# EAGLE design s-tuner_prototype (EAGLE 6.1)
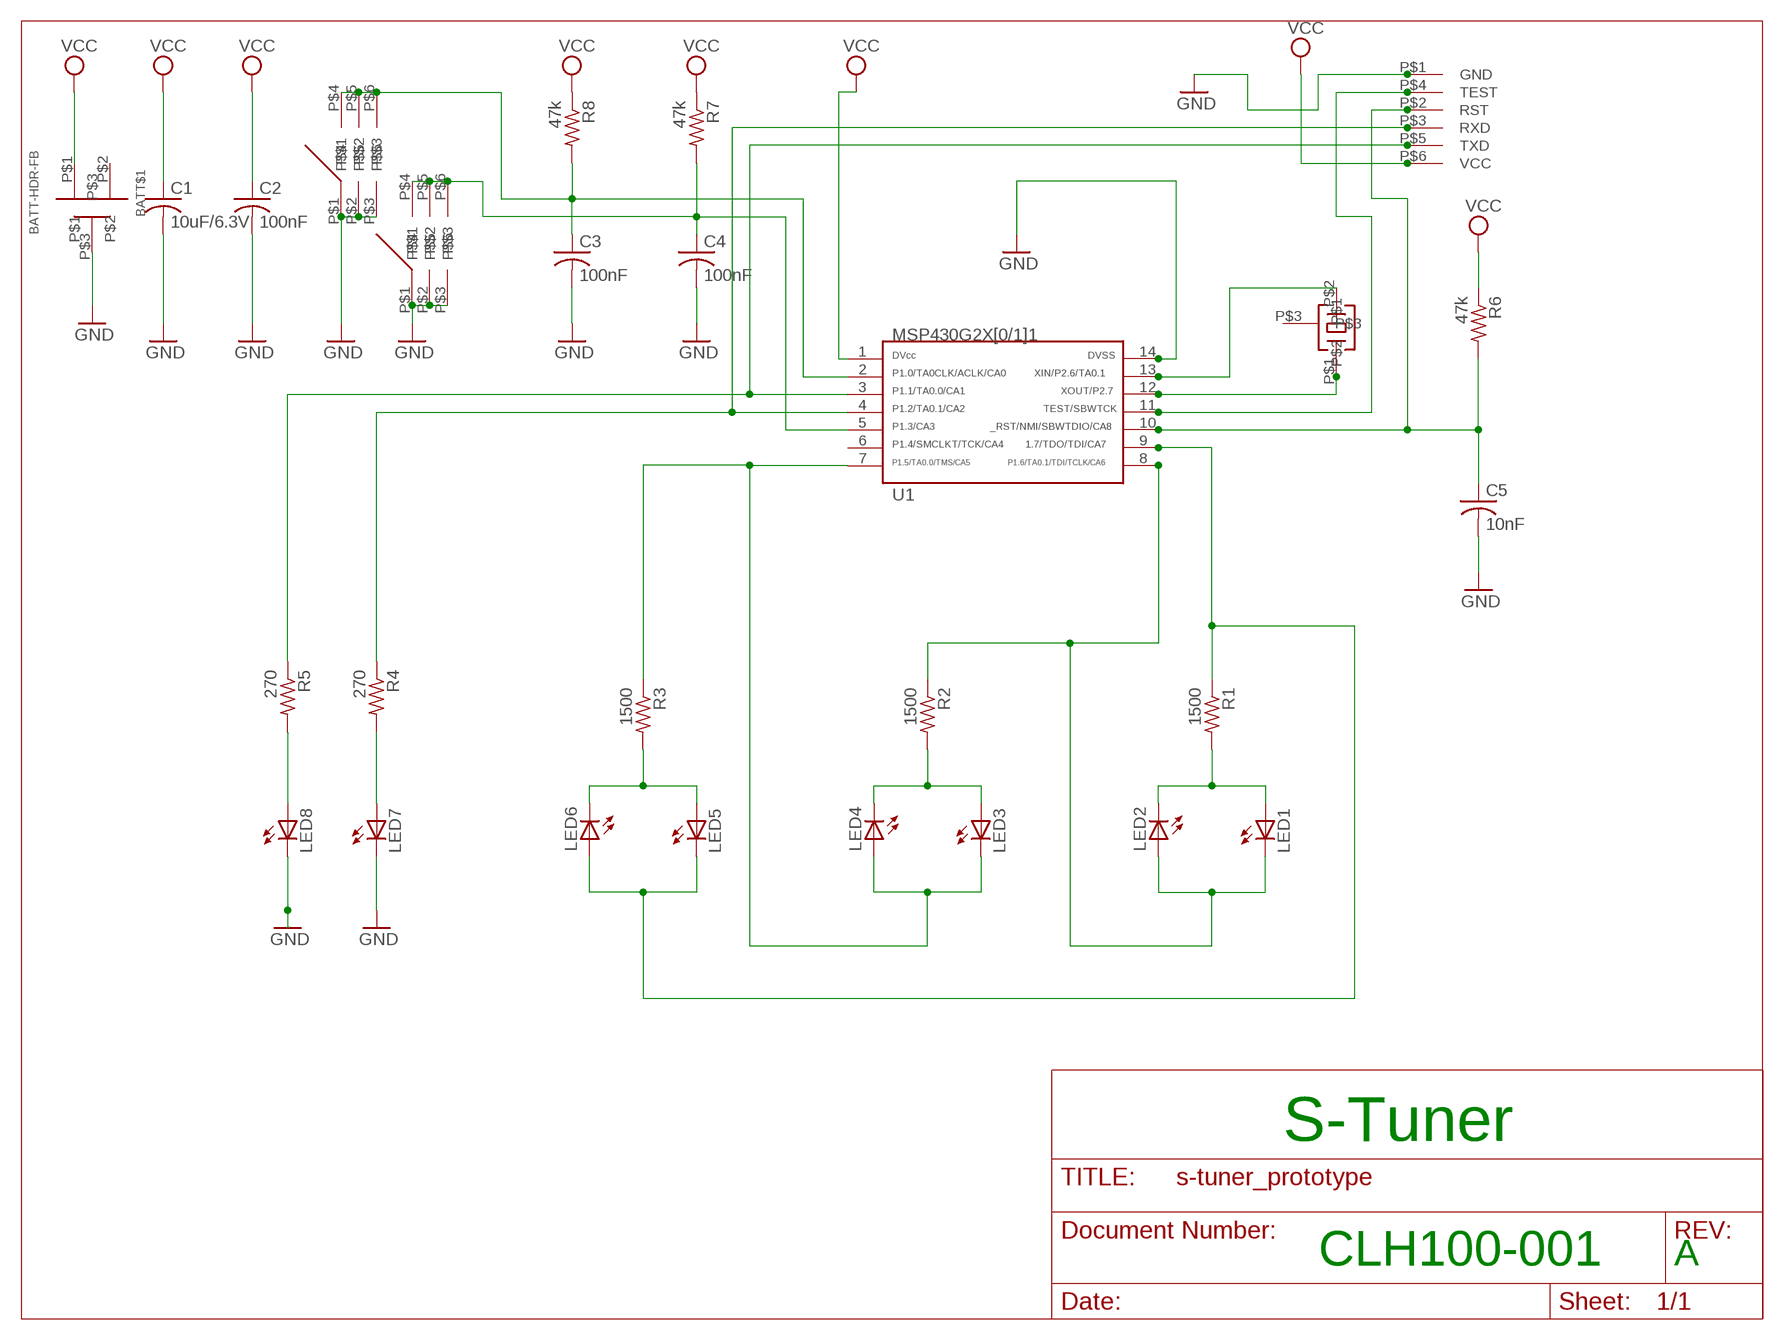
[diagram p0: schematic, sheet 1]

## Parts
BATT1  BATT1  BATT-HDR-FB  [BATT-HDR-FB]
C1  10uF/6.3V  C-USC1206K  [C1206K]
C2  100nF  C-USC0603  [C0603]
C3  100nF  C-USC0603  [C0603]
C4  100nF  C-USC0603  [C0603]
C5  10nF  C-USC0603  [C0603]
LED1  LEDSML0805  [SML0805]
LED2  LEDSML0805  [SML0805]
LED3  LEDSML0805  [SML0805]
LED4  LEDSML0805  [SML0805]
LED5  LEDSML0805  [SML0805]
LED6  LEDSML0805  [SML0805]
LED7  LED3MM  [LED3MM]
LED8  LED3MM  [LED3MM]
R1  1500  R-US_R0603  [R0603]
R2  1500  R-US_R0603  [R0603]
R3  1500  R-US_R0603  [R0603]
R4  270  R-US_R0603  [R0603]
R5  270  R-US_R0603  [R0603]
R6  47k  R-US_R0603  [R0603]
R7  47k  R-US_R0603  [R0603]
R8  47k  R-US_R0603  [R0603]
SW1  POLYCASE_FINGER_TRACE  [POLYCASE_FINGER_TRACE]
SW2  POLYCASE_FINGER_TRACE  [POLYCASE_FINGER_TRACE]
U1  G2X[0/1]1---PW14  [PW14]
U2  MICROCRYSTAL_32K  [MICROCRYSTAL_32K]
U$3  PROGRAMMING_HEADER  [PROGRAMMING_HEADER]

## Nets
GND: BATT1.P$3 C1.2 C2.2 C3.2 C4.2 C5.2 LED7.K(C) LED8.K(C) SW1.P$1 SW1.P$2 SW1.P$3 SW2.P$1 SW2.P$2 SW2.P$3 U1.14 U$3.P$1(GND)
N$1: U1.12 U2.P$1
N$2: C5.1 R6.2 U1.10 U$3.P$2(RST)
N$4: LED1.C LED2.A R2.1 U1.8
N$5: U1.13 U2.P$2
N$6: LED5.C LED6.A R1.1 U1.9
N$7: C3.1 R8.2 SW1.P$4 SW1.P$5 SW1.P$6 U1.2
N$8: LED5.A LED6.C R3.2
N$9: LED3.C LED4.A R3.1 U1.7
N$10: R4.1 U1.4 U$3.P$3(RXD)
N$11: LED1.A LED2.C R1.2
N$12: LED7.A R4.2
N$13: R5.1 U1.3 U$3.P$5(TXD)
N$15: LED3.A LED4.C R2.2
N$16: U1.11 U$3.P$4(TEST)
N$17: C4.1 R7.2 SW2.P$4 SW2.P$5 SW2.P$6 U1.5
N$19: LED8.A R5.2
VCC: BATT1.P$1 C1.1 C2.1 R6.1 R7.1 R8.1 U1.1 U$3.P$6(VCC)
Unconnected: BATT1.P$2 U1.6 U2.P$3

## Notes on the sheet
- S-Tuner
- CLH100-001 | A

## Library data of the parts
BATT1 = applied-knowledge:BATT-HDR-FB: 20mm Coin Cell Battery Holder from Polycase. http://www.polycase.com/uploads/28311299157745.pdf
C1 = rcl:C-US: CAPACITOR, American symbol
C2-C5 = resistor:C-US: CAPACITOR, American symbol
LED1-LED8 = led:LED: LED OSRAM: - CHIPLED LG R971, LG N971, LY N971, LG Q971, LY Q971, LO R971, LY R971 LH N974, LH R974 LS Q976, LO Q976, LY Q976 LO Q996 - Hyper CHIPLED LW Q18S LB Q993, LB Q99A, LB R99A - SideLED LS A670, LO A670, LY A670, LG A670, LP A670 LB A673, LV A673, LT A673, LW A673 LH A674 LY A675 LS A676, LA A676, LO A676, LY A676, LW A676 LS A679, LY A679, LG A679 - Hyper Micro SIDELED® LS Y876, LA Y876, LO Y876, LY Y876 LT Y87S - SmartLED LW L88C, LW L88S LB L89C, LB L89S, LG L890 LS L89K, LO L89K, LY L89K LS L896, LA L896, LO L896, LY L896 - TOPLED LS T670, LO T670, LY T670, LG T670, LP T670 LSG T670, LSP T670, LSY T670, LOP T670, LYG T670 LG T671, LOG T671, LSG T671 LB T673, LV T673, LT T673, LW T673 LH T674 LS T676, LA T676, LO T676, LY T676, LB T676, LH T676, LSB T676, LW T676 LB T67C, LV T67C, LT T67C, LS T67K, LO T67K, LY T67K, LW E67C LS E67B, LA E67B, LO E67B, LY E67B, LB E67C, LV E67C, LT E67C LW T67C LS T679, LY T679, LG T679 LS T770, LO T770, LY T770, LG T770, LP T770 LB T773, LV T773, LT T773, LW T773 LH T774 LS E675, LA E675, LY E675, LS T675 LS T776, LA T776, LO T776, LY T776, LB T776 LHGB T686 LT T68C, LB T68C - Hyper Mini TOPLED® LB M676 - Mini TOPLED Santana® LG M470 LS M47K, LO M47K, LY M47K Source: http://www.osram.convergy.de LUXEON: - LUMILED® LXK2-PW12-R00, LXK2-PW12-S00, LXK2-PW14-U00, LXK2-PW14-V00 LXK2-PM12-R00, LXK2-PM12-S00, LXK2-PM14-U00 LXK2-PE12-Q00, LXK2-PE12-R00, LXK2-PE12-S00, LXK2-PE14-T00, LXK2-PE14-U00 LXK2-PB12-K00, LXK2-PB12-L00, LXK2-PB12-M00, LXK2-PB14-N00, LXK2-PB14-P00, LXK2-PB14-Q00 LXK2-PR12-L00, LXK2-PR12-M00, LXK2-PR14-Q00, LXK2-PR14-R00 LXK2-PD12-Q00, LXK2-PD12-R00, LXK2-PD12-S00 LXK2-PH12-R00, LXK2-PH12-S00 LXK2-PL12-P00, LXK2-PL12-Q00, LXK2-PL12-R00 Source: www.luxeon.com KINGBRIGHT: KA-3528ASYC Source: www.kingbright.com
R1-R8 = resistor:R-US_: RESISTOR, American symbol
SW1 SW2 = applied-knowledge:POLYCASE_FINGER_TRACE: Polycase Finger Trace to use with Polycase keyfob
U1 = TI_MSP430_v16:G2X[0/1]1---PW14: MSP430G2X[0/1]1 MSP430G2001, MSP430G2101, MSP430G2201,MSP430G2111, G2211 TSSOP (PW) 14 Pin Package http://focus.ti.com/docs/prod/folders/print/msp430g2111.html
U2 = applied-knowledge:MICROCRYSTAL_32K: Microcrystal MS1V-T1K Tuning Fork Crystal
U$3 = applied-knowledge:PROGRAMMING_HEADER

## Board
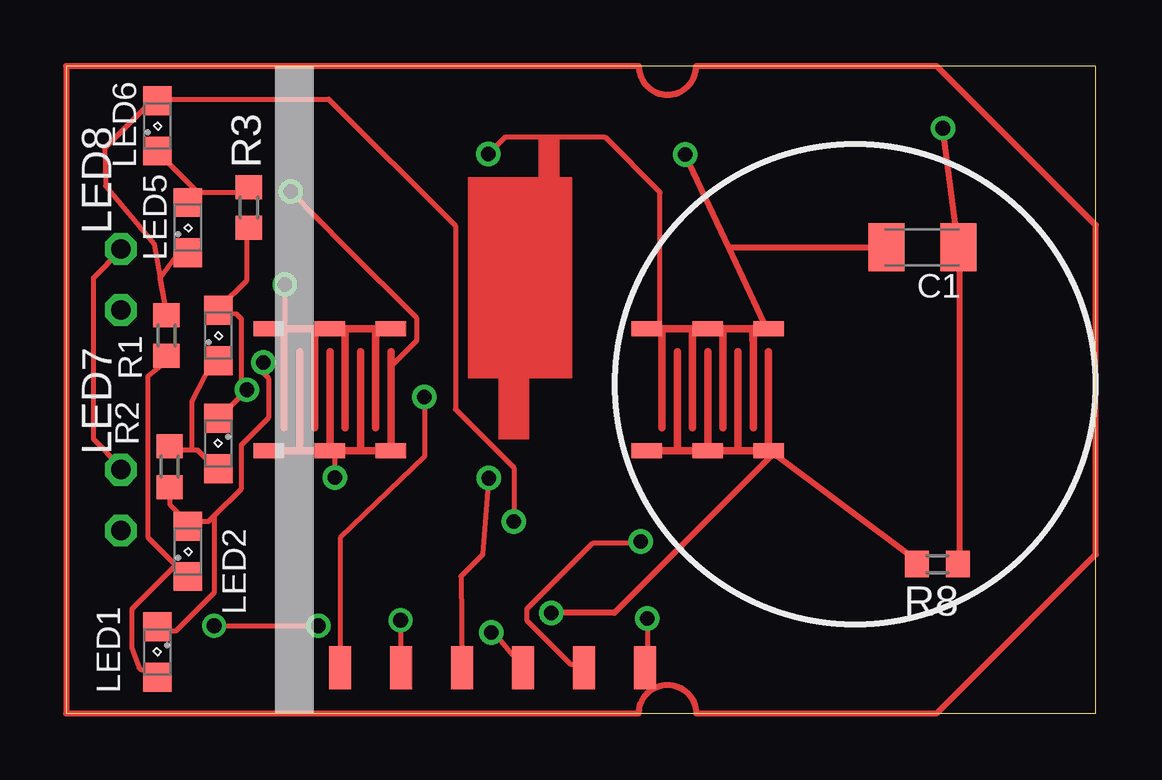
[diagram p1: board, top side]
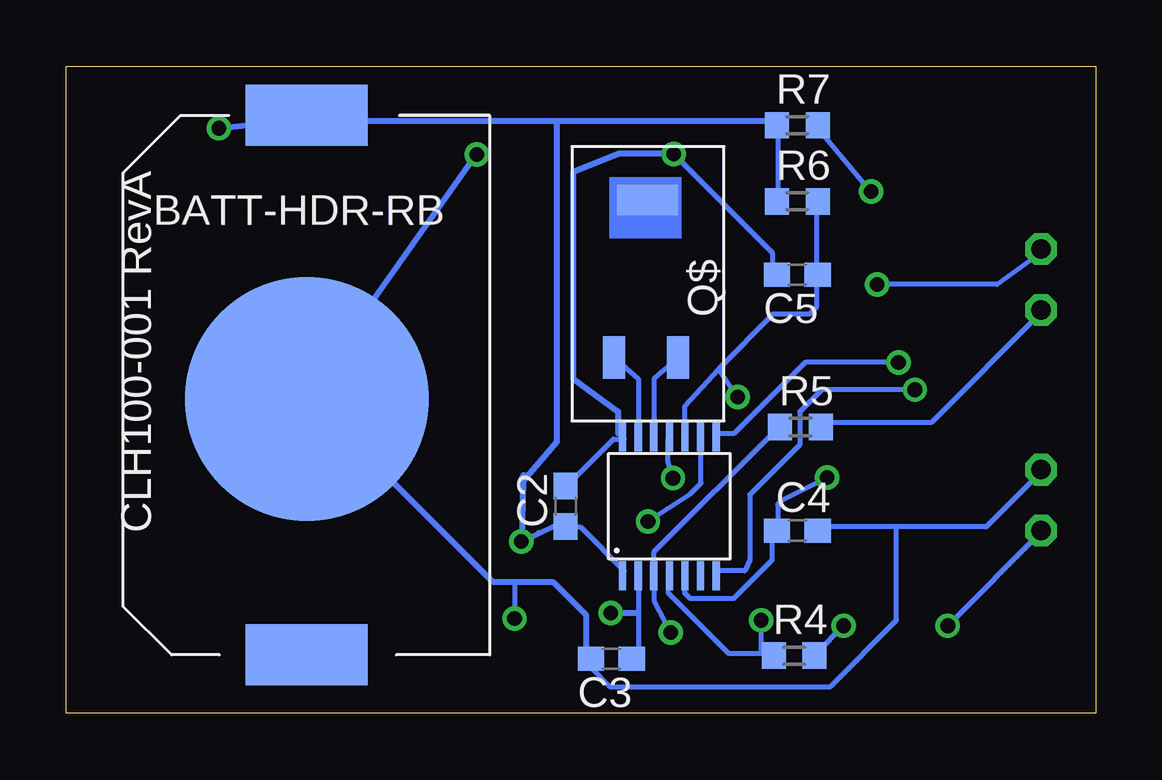
[diagram p2: board, bottom side, seen from below]

Size 42.93 x 26.97 mm. Coordinates in mm from the lower left corner, seen from the top.
Outline: 0,0 42.93,0 42.93,26.98 0,26.98 0,0
Copper layers (1*16): Top 0.035mm / dielectric 1.5mm / Bottom 0.035mm
Design rules: minimum track width 8mil, minimum drill 24mil, track to track 8mil, track to pad 8mil, pad to pad 8mil, via to via 8mil, smd to smd 8mil, copper to edge 40mil, drill to drill 8mil, minimum pad ring 10mil, minimum via ring 8mil, stop-mask expansion 4mil, vias tented up to drill 0mil, thermal gap 10mil
bKeepout: area 17,15.7 to 20.8,19.8
bRestrict: area 17,15.7 to 20.8,19.8

### Footprints (pad centres in the part's own frame; a part is rotated, then mirrored left to right if it is on the bottom)
BATT-HDR-FB = smd 5.08 x 2.54: P$1 7.62,0; P$2 7.62,22.479 | smd 10.16 x 10.16: P$3 7.62,11.811
C1206K = smd 1.5 x 2: 1 -1.5,0; 2 1.5,0
C0603 = smd 1.1 x 1: 1 -0.85,0; 2 0.85,0
SML0805 = smd 1.2 x 1.2: A 1.05,0; C -1.05,0
LED3MM = drill 0.813 octagon: A -1.27,0; K 1.27,0
R0603 = smd 1 x 1.1: 1 -0.85,0; 2 0.85,0
POLYCASE_FINGER_TRACE = smd 1.27 x 0.635: P$1 0,0; P$2 2.54,0; P$3 5.08,0; P$4 5.08,5.08; P$5 2.54,5.08; P$6 0,5.08
PW14 = smd 0.3 x 1.2: 1 -1.95,-2.9; 2 -1.3,-2.9; 3 -0.65,-2.9; 4 0,-2.9; 5 0.65,-2.9; 6 1.3,-2.9; 7 1.95,-2.9; 8 1.95,2.9; 9 1.3,2.9; 10 0.65,2.9; 11 0,2.9; 12 -0.65,2.9; 13 -1.3,2.9; 14 -1.95,2.9
MICROCRYSTAL_32K = smd 1.778 x 0.914: P$1 7.518,3.15; P$2 7.518,0.483 | smd 1.27 x 2.54: P$3 0.965,1.88
PROGRAMMING_HEADER = smd 1.778 x 0.914: P$1 0,12.7; P$2 0,0; P$3 0,2.54; P$4 0,5.08; P$5 0,7.62; P$6 0,10.16

### Placement (x,y rotation side)
BATT1  25.27,24.92 180 bottom
C1  35.69,19.43 180 top
C2  22.1,8.64 90 bottom
C3  20.19,2.29 180 bottom
C4  12.45,7.62 0 bottom
C5  12.45,18.29 180 bottom
LED1  3.81,2.57 270 top
LED2  5.08,6.76 90 top
LED3  6.35,11.25 270 top
LED4  6.35,15.75 90 top
LED5  5.08,20.24 90 top
LED6  3.81,24.49 90 top
LED7  2.29,8.89 90 top
LED8  2.29,18.08 90 top
R1  4.19,15.75 270 top
R2  4.32,10.29 90 top
R3  7.62,21.08 90 top
R4  12.57,2.41 0 bottom
R5  12.32,11.94 0 bottom
R6  12.45,21.34 0 bottom
R7  12.45,24.51 0 bottom
R8  36.32,6.22 180 top
SW1  29.29,16.03 180 top
SW2  13.54,16.03 180 top
U1  17.78,8.64 0 bottom
U2  20.57,22.35 270 bottom
U$3  11.43,1.91 270 top

### Tracks (layer width: path | path; a pad name or v marks a point on that pad's centre or on a via)
GND  (via drill 0.61)
  Top 0.203: v17.6,23.32 18.29,24 22.48,24 24.77,21.72 24.77,16 28.57,16 28.65,11.9 | SW1.P$1 29.23,15.98 | SW1.P$2 26.75,16 26.11,16.03 | SW2.P$2 10.97,16 10.36,16.03 | LED8.K 2.29,19.3 1.14,18.16 1.14,11.43 2.29,10.29 LED7.K | v9.12,17.88 9.12,16.23 8.46,16 SW2.P$3 | 27.66,19.43 27.62,19.41 | v24.23,3.96 24.23,2.06 U$3.P$1
  Top 0.254: v25.81,23.29 27.62,19.41 29.23,15.98 | 27.66,19.43 C1.2
  Bottom 0.203: v17.6,23.32 13.49,19.2 13.49,18.29 C5.2 | 8.31,7.77 4.57,7.77 2.29,10.06 LED7.K | 8.31,7.77 11.43,7.77 C4.2 | 21.26,2.74 C3.2 21.03,1.88 20.27,1.12 11.07,1.12 8.31,3.89 8.31,7.77 | 21.95,9.37 C2.2 21.95,9.6 20.12,11.43 19.66,11.43 U1.14 19.91,11.66 | 32.69,13.03 BATT1.P$3 32.92,13.26 | v9.12,17.88 4.12,17.88 2.29,19.2 LED8.K | 24.23,5.49 v24.23,3.96
  Bottom 0.254: 21.26,2.74 21.26,4.12 22.61,5.46 22.66,5.49 24.23,5.49 25.15,5.49 32.69,13.03 | 32.92,13.26 v25.81,23.29 | 19.91,11.66 19.91,12.57 21.79,13.95 21.79,22.55 19.89,23.32 v17.6,23.32
N$1
  Bottom 0.203: U1.12 18.41,11.66 18.41,13.95 17.6,14.63 U2.P$1
N$2  (via drill 0.61)
  Top 0.203: v14.94,13.18 14.94,10.69 11.43,7.32 U$3.P$2
  Bottom 0.203: 11.66,18.29 11.66,21.26 R6.2 | 11.66,18.29 11.66,16.92 11.94,16.64 13.46,16.64 15.72,14.35 | 15.72,14.35 17.14,12.8 17.14,11.66 U1.10 | 11.66,18.29 C5.1 | 15.72,14.35 v14.94,13.18
N$4  (via drill 0.61)
  Top 0.203: R2.1 4.34,9.37 4.34,8.69 5.03,8 LED2.A 5.26,8 5.94,8 6.17,8.23 | v8.23,14.63 8.23,14.17 8.46,13.95 8.46,12.34 7.32,11.2 7.32,9.37 6.17,8.23 | 6.17,8.23 6.17,5.03 4.57,3.43 3.89,3.43 LED1.C
  Bottom 0.203: v8.23,14.63 12.12,14.63 15.09,11.66 15.77,11.66 U1.8
N$5
  Bottom 0.203: U2.P$2 19.07,13.95 19.07,11.66 U1.13
N$6  (via drill 0.61)
  Top 0.203: v18.67,8 18.67,10.24 16.23,12.68 16.23,20.32 10.95,25.6 3.89,25.6 LED6.A 3.66,25.6 1.6,23.55 1.65,21.97 3.68,19.56 R1.1 3.91,18.11 5.03,19.66 5.03,19.2 LED5.C
  Bottom 0.203: v18.67,8 16.92,9.14 16.46,9.6 16.46,11.43 U1.9
N$7  (via drill 0.61)
  Top 0.203: 35.43,6.4 R8.2 | 29.39,10.92 SW1.P$6 | 29.64,10.97 SW1.P$5
  Top 0.254: 29.39,10.92 35.43,6.4 | v20.22,4.19 22.86,4.19 29.64,10.97
  Bottom 0.203: C3.1 19.07,2.74 19.07,4.19 19.07,5.71 U1.2
  Bottom 0.254: v20.22,4.19 19.07,4.19
N$8
  Top 0.203: 3.89,23.55 LED6.C 3.89,23.32 5.49,21.72 | 5.49,21.72 5.26,21.49 LED5.A 5.49,21.72 | 5.49,21.72 7.54,21.72 R3.2
N$9  (via drill 0.61)
  Top 0.203: R3.1 7.54,20.12 7.54,18.06 6.4,16.92 LED4.A 6.4,16.69 7.11,16.64 7.32,16.43 7.32,13.26 | 7.32,13.26 6.4,12.34 LED3.C | 7.32,13.26 v7.54,13.49
  Bottom 0.203: v7.54,13.49 11.43,13.49 12.34,12.57 12.34,11.2 14.43,9.12 14.43,6.4 14.63,5.94 15.77,5.94 U1.7
N$10  (via drill 0.61)
  Top 0.203: v13.95,3.89 13.95,2.31 U$3.P$3
  Bottom 0.203: 13.95,2.52 15.32,2.52 17.83,5.03 17.83,5.71 U1.4 | 13.95,2.52 13.49,2.52 R4.1 | 13.95,2.52 v13.95,3.89
N$11
  Top 0.203: 4.57,6.17 5.03,5.71 LED2.C 4.57,6.17 | 4.57,6.17 3.43,7.32 3.43,14.07 4.27,14.76 R1.2 | 4.57,6.17 2.74,4.34 2.74,2.74 3.05,1.91 3.12,1.83 3.66,1.83 3.66,1.37 LED1.A
N$12  (via drill 0.61)
  Top 0.203: v6.17,3.66 v10.52,3.66
  Bottom 0.203: v10.52,3.66 11.66,2.52 R4.2 | v6.17,3.66 2.29,7.54 LED7.A
N$13  (via drill 0.61)
  Top 0.203: v17.73,3.38 17.98,3.17 U$3.P$5
  Bottom 0.203: 18.41,5.94 18.41,6.73 13.26,11.89 R5.1 | 18.41,5.94 U1.3 | 18.41,5.94 18.41,4.7 v17.73,3.38
N$14
  Top 0.254: 26.26,26.98 36.3,26.98 42.93,20.34 42.93,6.63 36.3,0 26.26,0 arc180 23.88,0
N$15
  Top 0.203: 5.26,10.97 5.49,10.97 6.17,10.29 LED3.A | 5.26,10.97 4.34,10.97 R2.2 | 5.26,10.97 5.26,13.03 5.79,14.07 6.17,14.63 LED4.C
N$16  (via drill 0.61)
  Top 0.203: v17.63,9.8 17.37,6.63 16.46,5.71 U$3.P$4
  Bottom 0.203: v17.63,9.8 17.83,10.52 17.83,11.43 U1.11
N$17  (via drill 0.61)
  Top 0.203: v9.37,21.74 11.66,19.43 14.63,16.46 14.63,15.54 13.49,14.4 SW2.P$6 | v11.2,9.83 11.2,10.74 SW2.P$5
  Bottom 0.203: U1.5 17.14,5.71 17.14,5.03 16.92,4.8 15.09,4.8 13.49,6.4 13.49,7.54 C4.1 13.26,7.77 13.26,8.71 13.08,8.89 v11.2,9.83 | v9.37,21.74 11.66,24.46 R7.2
N$18
  Top 0.254: 23.88,26.98 0,26.98 0,0 23.88,0
N$19
  Bottom 0.203: R5.2 11.43,12.12 6.86,12.12 2.29,16.69 LED8.A
N$20
  Top 0.254: 23.88,26.98 arc180 26.26,26.98
VCC  (via drill 0.61)
  Top 0.203: 37.03,6.4 R8.1 37.26,6.4 | U$3.P$6 21.49,2.06 21.03,2.06 19.2,3.89 19.2,4.34 21.95,7.09 23.77,7.09 v23.95,7.16 | 37.26,18.97 37.26,19.43 C1.1 37.26,18.97
  Top 0.254: 37.26,6.4 37.26,18.97 v36.55,24.38
  Bottom 0.203: R6.1 13.26,21.49 13.26,24.46 R7.1 13.49,24.69 | 23.22,7.52 22.17,8 C2.1 21.95,7.77 21.49,7.77 19.66,5.94 U1.1 | v23.95,7.16 23.09,7.54 v23.95,7.17 | 33.15,24.77 29.03,24.69 | 34.75,24.92 34.98,24.69 BATT1.P$1 34.75,24.92
  Bottom 0.254: 34.98,24.69 29.03,24.69 22.53,24.69 | 22.53,24.69 13.49,24.69 | 22.53,24.69 22.48,24.64 22.48,11.3 23.98,9.55 23.85,9.93 23.88,9.65 v23.95,7.17 23.22,7.52 | v36.55,24.38 33.15,24.77
(copper drawn outside any net)
  shapes: Top area x3

### Text on the board
bNames: CLH100-001 RevA